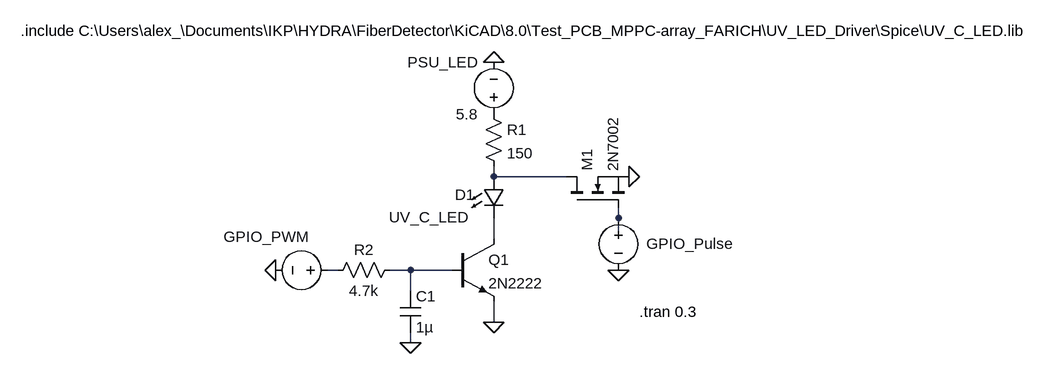
[diagram p0: schematic UV_LED_Driver.asc]
UV_LED_Driver.asc, the LTspice schematic file:
Version 4
SHEET 1 2168 692
WIRE 224 128 224 112
WIRE 336 128 224 128
WIRE 416 192 416 176
WIRE 224 224 224 192
WIRE 416 224 416 192
WIRE -16 272 -32 272
WIRE 96 272 64 272
WIRE 160 272 96 272
WIRE 96 304 96 272
WIRE 224 352 224 320
WIRE 96 384 96 368
FLAG 224 -48 0
FLAG 224 352 0
FLAG 96 384 0
FLAG -112 272 0
FLAG 432 128 0
FLAG 416 272 0
SYMBOL res 208 16 R0
SYMATTR InstName R1
SYMATTR Value 150
SYMBOL voltage 224 48 R180
WINDOW 0 24 96 Left 2
WINDOW 3 24 16 Left 2
WINDOW 123 0 0 Left 0
WINDOW 39 0 0 Left 0
SYMATTR InstName PSU_LED
SYMATTR Value 5.8
SYMBOL npn 160 224 R0
SYMATTR InstName Q1
SYMATTR Value 2N2222
SYMBOL res 80 256 R90
WINDOW 0 0 56 VBottom 2
WINDOW 3 32 56 VTop 2
SYMATTR InstName R2
SYMATTR Value 4.7k
SYMBOL cap 80 304 R0
SYMATTR InstName C1
SYMATTR Value 1µ
SYMBOL voltage -16 272 R90
WINDOW 0 -36 110 VBottom 2
WINDOW 3 34 129 Invisible 1
WINDOW 123 0 0 Left 0
WINDOW 39 0 0 Left 0
SYMATTR InstName GPIO_PWM
SYMATTR Value PULSE(0 3.3 0.15 0 0 2u 5u 1000000)
SYMBOL nmos 336 176 R270
SYMATTR InstName M1
SYMATTR Value 2N7002
SYMBOL voltage 416 176 R0
WINDOW 0 110 71 Bottom 2
WINDOW 3 242 87 Invisible 1
WINDOW 123 0 0 Left 0
WINDOW 39 0 0 Left 0
SYMATTR InstName GPIO_Pulse
SYMATTR Value PULSE(0 3.3 0.2 0 0 100n 200n 10000)
SYMBOL LED 208 128 R0
WINDOW 0 -44 28 Left 2
WINDOW 3 -145 63 Left 2
SYMATTR InstName D1
SYMATTR Value UV_C_LED
TEXT 448 336 Left 2 !.tran 0.3
TEXT -504 -96 Left 2 !.include C:\\Users\\alex_\\Documents\\IKP\\HYDRA\\FiberDetector\\KiCAD\\8.0\\Test_PCB_MPPC-array_FARICH\\UV_LED_Driver\\Spice\\UV_C_LED.lib

The netlist it stands for:
* UV_LED_Driver.asc
R1 P001 N001 150
V§PSU_LED P001 0 5.8
Q1 N003 N005 0 0 2N2222
R2 N005 N004 4.7k
C1 N005 0 1µ
V§GPIO_PWM N004 0 PULSE(0 3.3 0.15 0 0 2u 5u 1000000)
M1 N001 N002 0 0 2N7002
V§GPIO_Pulse N002 0 PULSE(0 3.3 0.2 0 0 100n 200n 10000)
D1 N001 N003 UV_C_LED
.model D D
.lib standard.dio
.model NPN NPN
.model PNP PNP
.lib standard.bjt
.model NMOS NMOS
.model PMOS PMOS
.lib standard.mos
.tran 0.3
.include C:\Users\alex_\Documents\IKP\HYDRA\FiberDetector\KiCAD\8.0\Test_PCB_MPPC-array_FARICH\UV_LED_Driver\Spice\UV_C_LED.lib
.backanno
.end